# EAGLE design Z-Control-V2 (EAGLE 8.2.2)
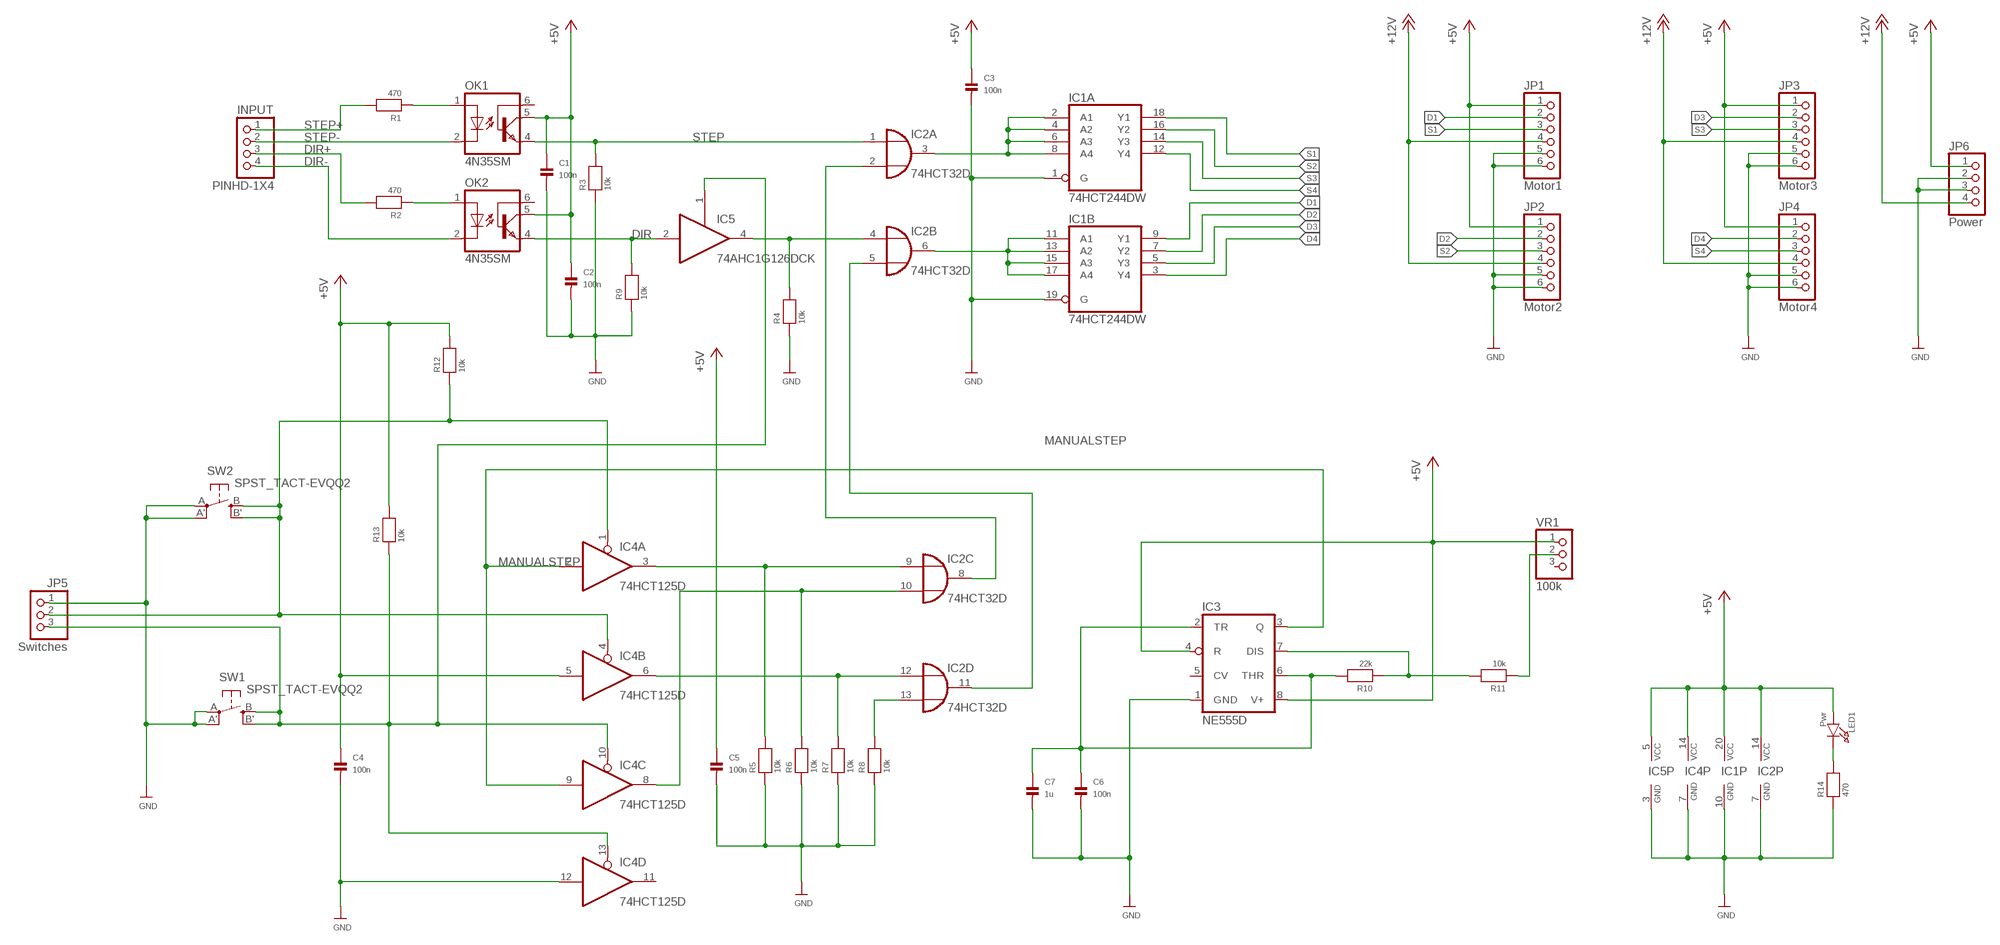
[diagram p0: schematic, sheet 1]

## Parts
C1  100n  CAP_CERAMIC_0805  [_0805]
C2  100n  CAP_CERAMIC_0805  [_0805]
C3  100n  CAP_CERAMIC_0805  [_0805]
C4  100n  CAP_CERAMIC_0805  [_0805]
C5  100n  CAP_CERAMIC_0805  [_0805]
C6  100n  CAP_CERAMIC_0805  [_0805]
C7  1u  CAP_CERAMIC_0805  [_0805]
IC1  74HCT244DW  [SO20W]
IC2  74HCT32D  [SO14]
IC3  NE555D  [SO08]
IC4  74HCT125D  [SO14]
IC5  74AHC1G126DCK  [SC70-5]
INPUT  PINHD-1X4  [1X04-BIG]
JP1  Motor1  PINHD-1X6  [1X06]
JP2  Motor2  PINHD-1X6  [1X06]
JP3  Motor3  PINHD-1X6  [1X06]
JP4  Motor4  PINHD-1X6  [1X06]
JP5  Switches  PINHD-1X3  [1X03]
JP6  Power  PINHD-1X4  [1X04-BIG]
LED1  Pwr  LED0805  [CHIPLED_0805]
OK1  4N35SM  [DIL6-SMD]
OK2  4N35SM  [DIL6-SMD]
R1  470  RESISTOR_0805  [_0805]
R2  470  RESISTOR_0805  [_0805]
R3  10k  RESISTOR_0805  [_0805]
R4  10k  RESISTOR_0805  [_0805]
R5  10k  RESISTOR_0805  [_0805]
R6  10k  RESISTOR_0805  [_0805]
R7  10k  RESISTOR_0805  [_0805]
R8  10k  RESISTOR_0805  [_0805]
R9  10k  RESISTOR_0805  [_0805]
R10  22k  RESISTOR_0805  [_0805]
R11  10k  RESISTOR_0805  [_0805]
R12  10k  RESISTOR_0805  [_0805]
R13  10k  RESISTOR_0805  [_0805]
R14  470  RESISTOR_0805  [_0805]
SW1  SPST_TACT-EVQQ2  [EVQ-Q2]
SW2  SPST_TACT-EVQQ2  [EVQ-Q2]
VR1  100k  HEADER-1X3  [1X03_OVAL]

## Nets
+5V: C1.1 C2.1 C3.1 C4.1 C5.1 IC1.20(P:VCC) IC2.14(P:VCC) IC3.4(R) IC3.8(V+) IC4.5(B:I) IC4.14(P:VCC) IC5.5(VCC) JP1.1 JP2.1 JP3.1 JP4.1 JP6.1 LED1.A OK1.5(COL) OK2.5(COL) R12.2 R13.2 VR1.1
+12V: JP1.4 JP2.4 JP3.4 JP4.4 JP6.4
D1: IC1.9(B:Y1) JP1.2
D2: IC1.7(B:Y2) JP2.2
D3: IC1.5(B:Y3) JP3.2
D4: IC1.3(B:Y4) JP4.2
DIR: IC5.2(I) OK2.4(EMI) R9.2
DIR+: INPUT.3 R2.2
DIR-: INPUT.4 OK2.2(C)
GND: C1.2 C2.2 C3.2 C4.2 C5.2 C6.2 C7.2 IC1.1(A:G) IC1.10(P:GND) IC1.19(B:G) IC2.7(P:GND) IC3.1(GND) IC4.7(P:GND) IC4.12(D:I) IC5.3(GND) JP1.5 JP1.6 JP2.5 JP2.6 JP3.5 JP3.6 JP4.5 JP4.6 JP5.1 JP6.2 JP6.3 R3.1 R4.1 R5.1 R6.1 R7.1 R8.1 R9.1 R14.1 SW1.A'(P1) SW1.A(P) SW2.A'(P1) SW2.A(P)
MANUALSTEP: IC3.3(Q) IC4.2(A:I) IC4.9(C:I)
N$1: IC4.10(C:OE) IC4.13(D:OE) IC5.1(OE) JP5.3 R13.1 SW1.B'(S1) SW1.B(S)
N$2: IC2.13(D:I1) R8.2
N$3: OK1.1(A) R1.1
N$4: IC2.4(B:I0) IC5.4(O) R4.2
N$5: OK2.1(A) R2.1
N$6: IC4.1(A:OE) IC4.4(B:OE) JP5.2 R12.1 SW2.B'(S1) SW2.B(S)
N$7: IC1.2(A:A1) IC1.4(A:A2) IC1.6(A:A3) IC1.8(A:A4) IC2.3(A:O)
N$8: IC1.11(B:A1) IC1.13(B:A2) IC1.15(B:A3) IC1.17(B:A4) IC2.6(B:O)
N$17: IC2.9(C:I0) IC4.3(A:O) R5.2
N$18: IC2.12(D:I0) IC4.6(B:O) R7.2
N$19: IC2.2(A:I1) IC2.8(C:O)
N$20: IC2.5(B:I1) IC2.11(D:O)
N$22: IC2.10(C:I1) IC4.8(C:O) R6.2
N$23: LED1.C R14.2
N$25: C6.1 C7.1 IC3.2(TR) IC3.6(THR) R10.2
N$26: IC3.7(DIS) R10.1 R11.2
N$27: R11.1 VR1.2
S1: IC1.18(A:Y1) JP1.3
S2: IC1.16(A:Y2) JP2.3
S3: IC1.14(A:Y3) JP3.3
S4: IC1.12(A:Y4) JP4.3
STEP: IC2.1(A:I0) OK1.4(EMI) R3.2
STEP+: INPUT.1 R1.2
STEP-: INPUT.2 OK1.2(C)
Unconnected: IC3.5(CV) IC4.11(D:O) OK1.6(BAS) OK2.6(BAS) VR1.3

## Library data of the parts
C1-C7 = microbuilder:CAP_CERAMIC: Ceramic Capacitors 0402 - 0402 Surface Mount Capacitors 16pF 50V 5% [Digikey: 445-4899-2-ND] 18pF 50V 5% [Digikey: 490-1281-2-ND] 22pF 50V 5% [Digikey: 490-1283-2-ND] 68pF 50V 5% [Digikey: 490-1289-2-ND] 0.1uF 10V 10% [Digikey: 490-1318-2-ND] 1.0uF 6.3V 10% [Digikey: 490-1320-2-ND] 0603 - 0603 Surface Mount Capacitors 16 pF 50V 5% [Digikey: 445-5051-2-ND] 22 pF 50V [Digikey: PCC220ACVTR-ND] 33 pF 50V 5% [Digikey: 490-1415-1-ND] 56pF 50V 5% [Digikey: 490-1421-1-ND] 220pF 50V 5% [Digikey: 445-1285-1-ND] 680 pF 50V 2200 pF 50V 5% C0G [Digikey: 445-1297-1-ND] 5600 pF 100V 5% X7R [Digikey: 478-3711-1-ND] 0.1 µF 25V 10% [Digikey: PCC2277TR-ND] 0.22 µF 16V 10% X7R [Digikey: 445-1318-1-ND] 1.0 µF 25V 10% [Digikey: 445-5146-2-ND] 0603 - RF Specific 3pF 250V +/-0.1pF RF [Digikey: 712-1347-1-ND] 18 pF 250V 5% [Digikey: 478-3505-1-ND or 712-1322-1-ND] 56 pF 250V 5% C0G RF [Digikey: 490-4867-1-ND] 68 pF 250V RF [Digikey: 490-4868-1-ND] 0805 - 0805 Surface Mount Capacitors 220 pF 250V 2% RF Ceramic Capacitor [Digikey: 712-1398-1-ND] 1000 pF 50V 2% NP0 Ceramic Capacitor [Digikey: 478-3760-1-ND] 0.1 µF 25V 10% Ceramic Capacitor [Digikey: PCC1828TR-ND] 1.0 µF 16V 10% Ceramic Capacitor[Digikey: 490-1691-2-ND] 10.0 µF 10V 10% Ceramic Capacitor[Digikey: 709-1228-1-ND] 10.0 uF 16V 10% Ceramic Capacitor [Digikey: 478-5165-2-ND] 47 uF 6.3V 20% Ceramic Capacitor [Digikey: 587-1779-1-ND or 399-5506-1-ND] 1206 - 1206 Surface Mount Capacitors 47uF 10V 20% Ceramic Capacitor [Digikey: 490-5528-1-ND or 399-5508-1-ND or 445-6010-1-ND] 100uF 6.3V -20%, +80% Y5V Ceramic Capacitor (Digikey: 490-4512-1-ND, Mouser: 81-GRM31CF50J107ZE1L)
IC1 = 74xx-eu:74*244: Octal BUFFER and LINE DRIVER, 3-state
IC2 = 74xx-eu:74*32: Quad 2-input OR gate
IC3 = adafruit:*555: TIMER Changed DIP package to have round (not oval) pin pads http://www.ladyada.net/library/pcb/eaglelibrary.html
IC4 = 74xx-eu:74*125: Quad bus BUFFER, 3-state
IC5 = 74xx-little-us:74*1G126: Single Bus Buffer Gate With 3-State Outputs
INPUT JP6 = adafruit:PINHD-1X4
JP1-JP4 = adafruit:PINHD-1X6: PIN HEADER
JP5 = adafruit:PINHD-1X3: PIN HEADER
LED1 = microbuilder:LED: LED 0603 - 0603 Surface Mount Package 2mA: Green LED - Low Power (3.9mcd, 2ma, 1.7Vf) - Digikey: 475-2709-2-ND Orange LED - Low Power (9.8mcd, 2ma, 1.8Vf) - Digikey: 475-1194-2-ND Red LED - Low Power (5mcd, 2ma, 1.8Vf) - Digikey: 475-1195-2-ND Yellow LED - Low Power (7mcd, 2ma, 1.8Vf) - Digikey: 475-1196-2-ND 5mA: Blue LED - Low Power (17mcd, 5ma, 2.9Vf) - Digikey: LNJ937W8CRACT-ND 0805 - 0805 Surface Mount Package 2mA: Red LED (8.8mcd, 2mA, 1.8Vf, Clear) - Low Power [Digikey: 475-2510-1-ND] Green LED (5mcd, 2mA, 1.8Vf, Clear) - Low Power [Digikey: 475-2730-1-ND] Yellow LED (11.3mcd, 2mA, 1.8Vf, Clear) - Low Power [Digikey: 475-2555-1-ND] 20mA: Red LED (104mcd, 20mA, Diffused) - LS R976 [Digikey: 475-1278-6-ND] Red LED (12mcd, 20mA, 2.0Vf, Clear) - APT2012EC [Digikey: 754-1128-1-ND] Green LED (15mcd, 20mA, 2.2Vf, Clear) - APT2012GC [Digikey: 754-1131-1-ND] Orange LED (160mcd, 20mA, 2.1Vf, Clear) - APT2012SECK [Digikey: 754-1130-1-ND] 1206 - 1206 Surface Mount Package Green LED (26mcd, 20mA, Diffused) - LG N971 [Digikey: 475-1407-6-ND] Red LED (15mcd, 20mA, Diffused) - LH N974 [Digikey: 475-1416-6-ND]
OK1 OK2 = optocoupler:4N*?M: General Purpose 6-Pin Phototransistor Optocouplers Source: http://www.fairchildsemi.com/ds/4N/4N35-M.pdf; MF: FAIRCHILD SEMICONDUCTOR; MPN: 4N35S-M; OC_FARNELL: 1021179; OC_NEWARK: 67K2285
R1-R14 = microbuilder:RESISTOR: Resistors 0402 - 0402 Surface Mount Package 22 Ohm 1% 1/16W [Digikey: 311-22.0LRTR-ND] 33 Ohm 5% 1/16W 1.0K 5% 1/16W 1.5K 5% 1/16W 2.0K 1% 1/16W 10.0K 1% 1/16W [Digikey: 311-10.0KLRTR-ND] 10.0K 5% 1/16W [Digikey: RMCF0402JT10K0TR-ND] 12.1K 1% 1/16W [Digikey: 311-22.0LRTR-ND] 100.0K 5% 1/16W 0603 - 0603 Surface Mount Package 0 Ohm 1/10 Watt 1% Resistor 15 Ohm 1/10 Watt 1% Resistor 33 Ohm 1/10 Watt 1% Resistor 49.9 Ohm 1/10 Watt 1% Resistor 100 Ohm 1/10 Watt 1% Resistor 150 Ohm 1/10 Watt 1% Resistor 240 Ohm 1/10 Watt 1% Resistor 390 Ohm 1/10 Watt 1% Resistor 560 Ohm 1/10 Watt 1% Resistor 680 Ohm 1/10 Watt 1% Resistor 750 Ohm 1/10 Watt 1% Resistor 1.0K Ohm 1/10 Watt 1% Resistor 1.5K Ohm 1/10 Watt 1% Resistor 2.0K Ohm 1/10 Watt 1% Resistor 2.2K Ohm 1/10 Watt 1% Resistor 3.3K Ohm 1/10 Watt 1% Resistor 4.7K Ohm 1/10 Watt 1% Resistor 10.0K Ohm 1/10 Watt 1% Resistor 12.0K Ohm 1/10 Watt 1% Resistor 12.1K Ohm 1/10 Watt 1% Resistor 20.0K Ohm 1/10 Watt 1% Resistor 33.0K Ohm 1/10 Watt 1% Resistor 100.0K Ohm 1/10 Watt 1% Resistor 0805 - 0805 Surface Mount Package 0 Ohm 1/8 Watt 1% Resistor 33 Ohm 1/8 Watt 1% Resistor 100 Ohm 1/8 Watt 1% Resistor 150 Ohm 1/8 Watt 1% Resistor 200 Ohm 1/8 Watt 1% Resistor 240 Ohm 1/8 Watt 1% Resistor 330 Ohm 1/8 Watt 1% Resistor 390 Ohm 1/8 Watt 1% Resistor 470 Ohm 1/8 Watt 1% Resistor 1.0K Ohm 1/8 Watt 1% Resistor 1.5K Ohm 1/8 Watt 1% Resistor 2.0K Ohm 1/8 Watt 1% Resistor 4.7K Ohm 1/8 Watt 1% Resistor 5.1K Ohm 1/8 Watt 1% Resistor 5.6K Ohm 1/8 Watt 1% Resistor 10.0K Ohm 1/8 Watt 1% Resistor 22.0K Ohm 1/8 Watt 1% Resistor 33.0K Ohm 1/8 Watt 1% Resistor 100K Ohm 1/8 Watt 1% Resistor 1206 - 1206 Surface Mount Package 2012 - 2010 Surface Mount Package 0.11 Ohm 1/2 Watt 1% Resistor - Digikey: RHM.11UCT-ND
SW1 SW2 = adafruit:SPST_TACT: SMT 6mm switch, EVQQ2 series http://www.ladyada.net/library/eagle
VR1 = microbuilder:HEADER-1X3: PIN HEADER

## Board
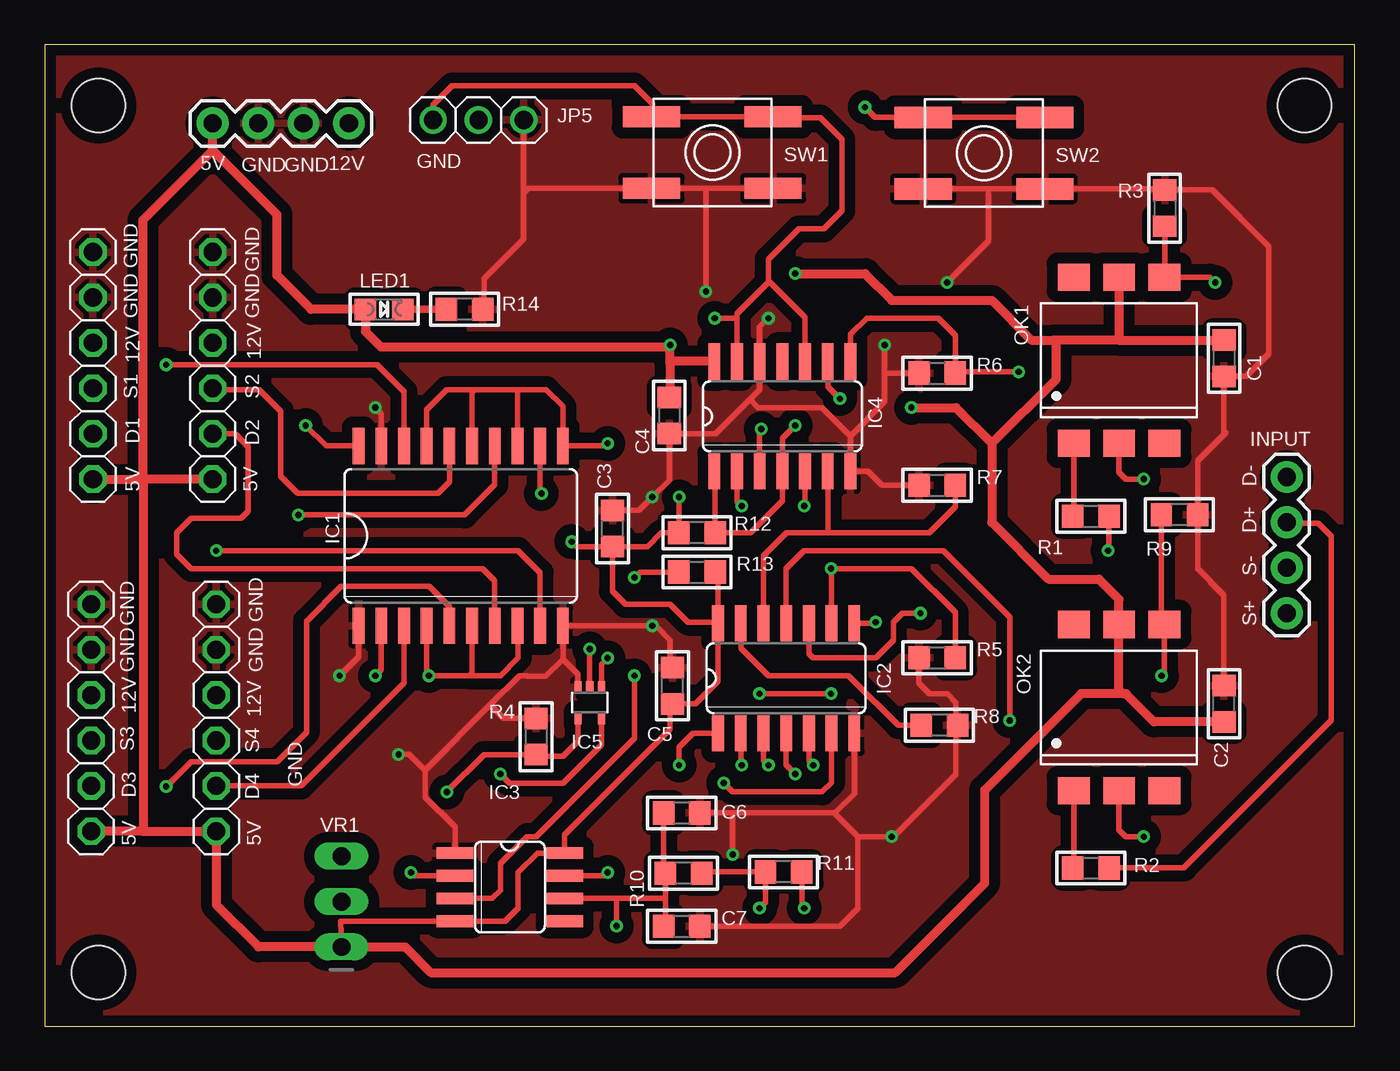
[diagram p1: board, top side]
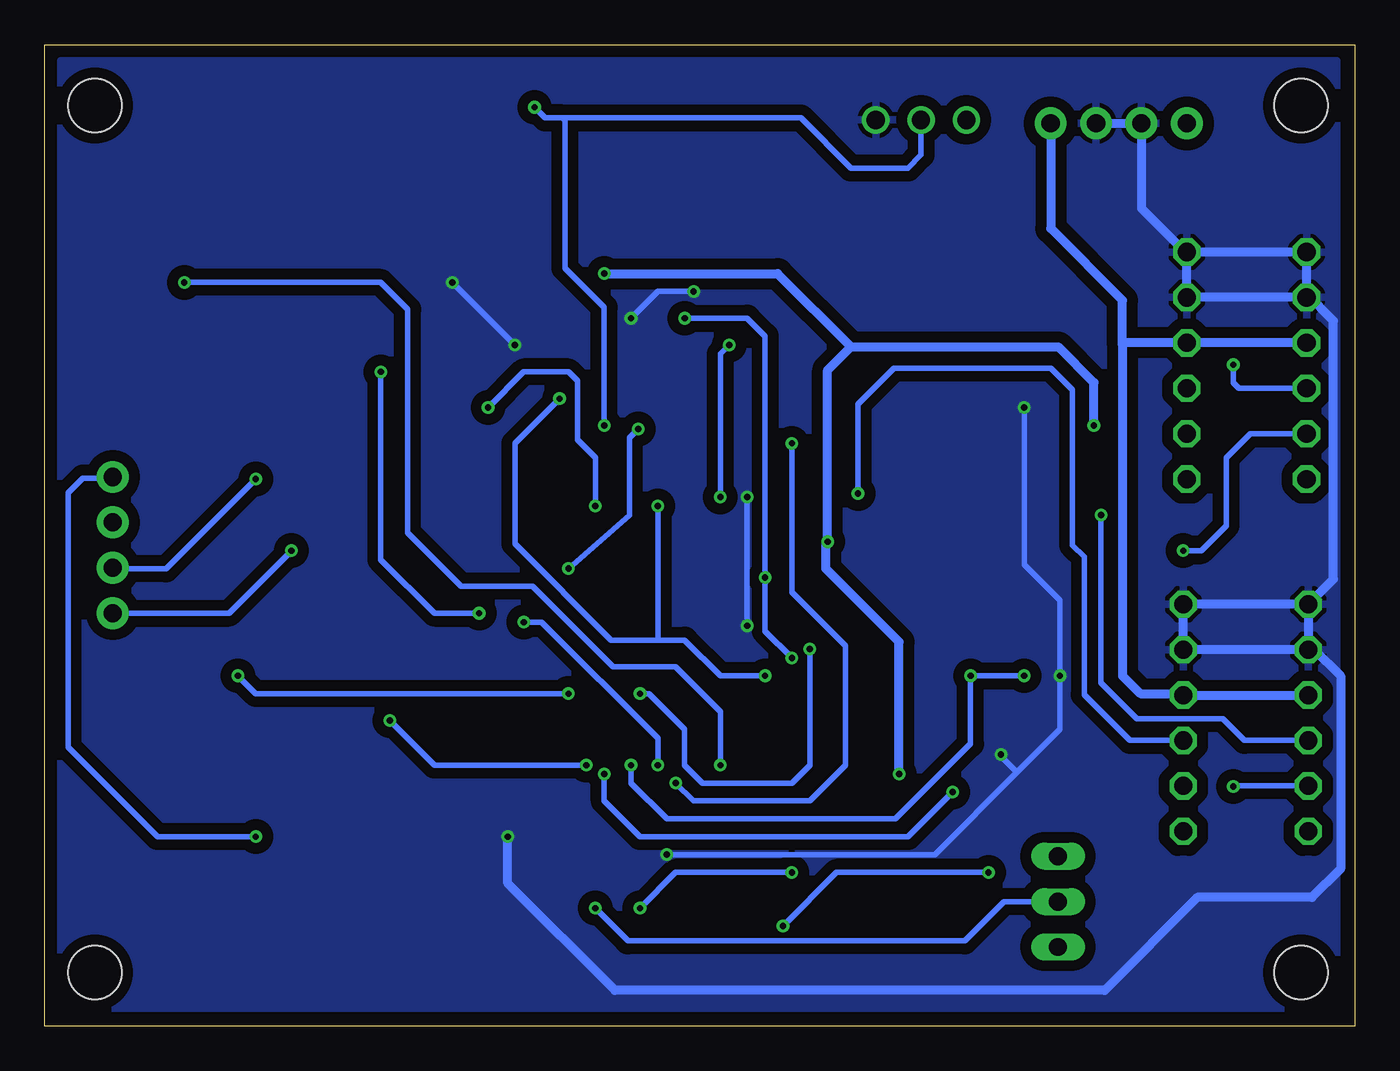
[diagram p2: board, bottom side, seen from below]

Size 73.31 x 54.9 mm. Coordinates in mm from the lower left corner, seen from the top.
Outline: 0,0 73.31,0 73.31,54.9 0,54.9 0,0
Copper layers (1*16): Top 0.0356mm / dielectric 1.5011mm / Bottom 0.0356mm
Design rules "oshpark-2layer": minimum track width 6mil, minimum drill 13mil, track to track 6mil, track to pad 6mil, pad to pad 6mil, via to via 6mil, smd to smd 6mil, copper to edge 15mil, drill to drill 6mil, minimum pad ring 7mil, minimum via ring 7mil, stop-mask expansion 2.5mil, vias tented up to drill 0mil, thermal gap 10mil
Holes 3 mm at 3,51.5 70.5,51.5 70.5,3 3,3

### Footprints (pad centres in the part's own frame; a part is rotated, then mirrored left to right if it is on the bottom)
_0805 = smd 1.2 x 1.3: 1 -1.016,0; 2 1.016,0
SO20W = smd 0.66 x 2.032: 1 -5.715,-5.029; 2 -4.445,-5.029; 3 -3.175,-5.029; 4 -1.905,-5.029; 5 -0.635,-5.029; 6 0.635,-5.029; 7 1.905,-5.029; 8 3.175,-5.029; 9 4.445,-5.029; 10 5.715,-5.029; 11 5.715,5.029; 12 4.445,5.029; 13 3.175,5.029; 14 1.905,5.029; 15 0.635,5.029; 16 -0.635,5.029; 17 -1.905,5.029; 18 -3.175,5.029; 19 -4.445,5.029; 20 -5.715,5.029
SO14 = smd 0.66 x 2.032: 1 -3.81,-3.073; 2 -2.54,-3.073; 3 -1.27,-3.073; 4 0,-3.073; 5 1.27,-3.073; 6 2.54,-3.073; 7 3.81,-3.073; 8 3.81,3.073; 9 2.54,3.073; 10 1.27,3.073; 11 0,3.073; 12 -1.27,3.073; 13 -2.54,3.073; 14 -3.81,3.073
SO08 = smd 0.66 x 2.032: 1 -1.905,-3.073; 2 -0.635,-3.073; 3 0.635,-3.073; 4 1.905,-3.073; 5 1.905,3.073; 6 0.635,3.073; 7 -0.635,3.073; 8 -1.905,3.073
SC70-5 = smd 0.4 x 0.7: 1 -0.65,-0.85; 2 0,-0.85; 3 0.65,-0.85; 4 0.65,0.85; 5 -0.65,0.85
1X04-BIG = drill 1.016 pad 1.778: 1 0,0; 2 2.54,0; 3 5.08,0; 4 7.62,0
1X06 = drill 1.016 octagon: 1 -6.35,0; 2 -3.81,0; 3 -1.27,0; 4 1.27,0; 5 3.81,0; 6 6.35,0
1X03 = drill 1.016: 1 -2.54,0; 2 0,0; 3 2.54,0
CHIPLED_0805 = smd 1.2 x 1.2: A 0,-1.05; C 0,1.05
DIL6-SMD = smd 1.78 x 1.52: 1 -2.54,-4.645; 2 0,-4.645; 3 2.54,-4.645; 4 2.54,4.645; 5 0,4.645; 6 -2.54,4.645
EVQ-Q2 = smd 3.2 x 1.2: A -3.4,-2; A' 3.4,-2; B -3.4,2; B' 3.4,2
1X03_OVAL = drill 1 long: 1 -2.54,0; 2 0,0; 3 2.54,0

### Placement (x,y rotation side)
C1  65.99,37.36 270 top
C2  65.99,18.04 90 top
C3  31.77,27.84 90 top
C4  34.95,34.16 270 top
C5  35.13,19.04 90 top
C6  35.65,11.93 0 top
C7  35.65,5.59 0 top
IC1  23.28,27.43 0 top
IC2  41.49,19.46 0 top
IC3  26.03,7.78 270 top
IC4  41.28,34.11 0 top
IC5  30.5,18.1 180 top
INPUT  69.5,23.1 90 top
JP1  2.7,36.95 90 top
JP2  9.4,36.95 90 top
JP3  2.6,17.25 90 top
JP4  9.6,17.25 90 top
JP5  24.27,50.69 180 top
JP6  9.4,50.5 0 top
LED1  19,40.1 270 top
OK1  60.12,37.25 0 top
OK2  60.12,17.82 0 top
R1  58.54,28.53 0 top
R2  58.54,8.85 0 top
R3  62.67,45.76 270 top
R4  27.5,16.2 270 top
R5  49.94,20.61 0 top
R6  49.94,36.53 0 top
R7  49.94,30.25 0 top
R8  50.06,16.83 180 top
R9  63.5,28.6 180 top
R10  35.75,8.55 180 top
R11  41.35,8.63 180 top
R12  36.5,27.6 180 top
R13  36.5,25.4 0 top
R14  23.5,40.1 180 top
SW1  37.36,48.87 0 top
SW2  52.56,48.84 0 top
VR1  16.61,6.97 90 top

### Tracks (layer width: path | path; a pad name or v marks a point on that pad's centre or on a via)
+5V  (via drill 0.35)
  Top 0.305: IC2.14 37.68,25.24 R13.2 | C3.1 33.72,26.82 34.5,27.6 R12.2 35.48,29.58 v35.5,29.6 | 37.39,37.1 IC4.14 | 35.02,38.1 v35,38.1 | v14.6,33.6 14.61,33.59 15.75,32.46 IC1.20 | C3.1 29.78,26.82 v29.5,27.1 | IC2.14 37.68,19.28 36.42,18.02 C5.1 35.05,18.1 35,18.05 35,16.6 29.1,10.7 IC3.8 27.59,9.69 26.5,8.6 26.5,6.6 25.77,5.88 IC3.4 16.57,5.88 VR1.1 | C3.1 31.77,24.33 32.5,23.6 35,23.6 36,22.6 37.61,22.6 IC2.14 | 17.5,40.1 LED1.A | IC4.5 42.55,29.15 v42.5,29.1 | IC5.5 31.15,15.75 29,13.6 26,13.6 v25.5,14.1
  Top 0.508: 5.5,30.56 5.5,45.1 9.4,49 | 5.5,10.9 JP3.1 | 5.5,10.9 JP4.1 9.6,6.8 11.97,4.43 VR1.1 20.17,4.43 21.6,3 47.6,3 52.6,8 52.6,13.2 58,18.6 60.34,18.6 | 5.5,30.56 5.5,10.9 | JP1.1 5.46,30.6 5.5,30.56 | 9.4,49 JP6.1 | JP2.1 5.54,30.6 5.5,30.56 | 60.34,18.6 60.5,18.6 62.08,17.02 C2.1 | 60.34,18.6 60.12,18.82 OK2.5 60.12,23.88 59,25 56.17,25 53,28.18 53,32.6 | 53,32.6 56.6,36.2 56.6,38.23 56.46,38.38 | v48.5,34.6 51,34.6 53,32.6 | 60.07,38.38 56.46,38.38 | 60.07,38.38 C1.1 | 56.46,38.38 55.22,38.38 53,40.6 47.4,40.6 45.9,42.1 v42,42.1 | OK1.5 60.12,38.42 60.07,38.38 | 9.4,49 13,45.4 13,42 14.9,40.1 LED1.A 17.95,38.85 18.8,38 34.92,38 35.02,38.1 | 35,37.02 v35,38.1 | 35,37.02 35,35.23 C4.1 | IC4.14 35.17,37.18 35,37.02
  Bottom 0.305: v35.5,29.6 35.5,37.6 v35,38.1 | v42.5,29.1 42.5,31.8 43.5,32.8 43.5,36.1 44,36.6 46.5,36.6 v48.5,34.6
  Bottom 0.508: v25.5,14.1 25.5,21.5 29.6,25.6 29.6,27 v29.5,27.1 29.5,36.7 28.2,38 | v14.6,33.6 14.6,36 16.6,38 28.2,38 | v42,42.1 32.3,42.1 28.2,38
+12V
  Bottom 0.508: JP1.4 JP2.4 12.88,38.22 13,38.1 | 13,38.1 13,40.6 17.02,44.62 JP6.4 | 13,38.1 13,19.6 12,18.6 9.68,18.6 JP4.4 JP3.4
D1  (via drill 0.35)
  Top 0.305: IC1.9 27.73,25.38 26.5,26.6 v9.6,26.6
  Bottom 0.305: JP1.2 5.86,33.14 7.2,31.8 7.2,28 8.6,26.6 v9.6,26.6
D2
  Top 0.305: IC1.7 25.18,24.91 24.5,25.6 8.2,25.6 7.4,26.4 7.4,27.6 8.2,28.4 11,28.4 11.4,28.8 11.4,32.4 10.66,33.14 JP2.2
D3  (via drill 0.35)
  Top 0.305: IC1.5 22.64,23.45 21.5,24.6 16.6,24.6 14.65,22.65 14.65,16.45 13,14.8 8.2,14.8 v6.8,13.4
  Bottom 0.305: JP3.2 6.76,13.44 v6.8,13.4
D4
  Top 0.305: IC1.3 20.11,19.2 18.51,17.61 | 18.51,17.61 18.19,17.29 | JP4.2 14.34,13.44 18.51,17.61
DIR  (via drill 0.35)
  Top 0.305: 62.64,22.48 OK2.4 62.66,22.35 | 62.66,22.35 62.66,19.76 v62.5,19.6 | v44,18.6 v40,18.6 | IC5.2 v30.5,21.1 | R9.2 62.48,22.53 62.66,22.35
  Bottom 0.305: v44,18.6 61.5,18.6 v62.5,19.6 | v40,18.6 39.5,18.6 37.5,16.6 37.5,14.6 36.5,13.6 31.5,13.6 30.5,14.6 v30.5,21.1
DIR+
  Top 0.305: R2.2 63.75,8.85 72,17.1 72,27.39 71.27,28.12 69.56,28.12 INPUT.3
DIR-  (via drill 0.35)
  Top 0.305: OK2.2 60.12,10.98 60.5,10.6 v61.5,10.6
  Bottom 0.305: v61.5,10.6 67,10.6 72,15.6 72,29.83 71.17,30.66 69.56,30.66 INPUT.4
GND  (via drill 0.35)
  Top 0.305: IC1.19 18.84,34.27 v18.5,34.6 | IC1.1 17.57,20.66 v16.5,19.6 | IC3.1 22.96,11.14 21.28,12.82 21.28,14.32 | 38.41,11.93 C6.2 | 38.41,11.93 44.17,11.93 44.2,11.9 | 44.2,11.9 45.5,10.6 | 45.5,10.6 45.5,6.6 44.49,5.59 C7.2 | 65.99,33.09 C1.2 67.24,36.34 68.5,37.6 68.5,43.6 65.32,46.78 R3.1 62.61,46.84 SW2.A' 52.8,46.84 | 66.1,33.2 65.99,33.09 | 36.96,46.87 SW1.A' | 36.96,46.87 SW1.A 27.08,46.87 26.81,46.6 | IC2.7 45.3,13 44.2,11.9 | R7.1 46.85,30.25 46.06,31.04 IC4.7 45.09,33.01 | 34.05,22.4 IC1.10 29,20.53 | 34.05,22.4 34.2,22.4 35,21.6 35,20.19 C5.2 | 39.46,35.06 40,35.6 IC4.12 40.01,39.11 v40.5,39.6 | 45.09,33.01 43.5,34.6 39.91,34.6 39.46,35.06 | 48.61,36.53 R6.1 47.04,36.53 47,36.57 | 45.09,33.01 47,34.92 47,36.57 | 39.46,35.06 37.54,33.14 C4.2 34.95,30.55 v34,29.6 | 47,36.57 v47,38.1 | 36.96,41.14 v37,41.1 37,46.83 36.96,46.87 | v34,29.6 33.86,29.6 | v34,22.4 34,22.45 34.05,22.4 | 29,20.53 28.03,19.57 27.03,19.57 27,19.6 26.56,19.6 24.93,17.97 | v38.5,9.6 38.5,11.84 38.41,11.93 | 45.5,10.6 v47.4,10.6 47.5,10.6 51,14.1 51,16.75 | 51,16.75 R8.1 | R5.1 48.92,19.18 49.5,18.6 50.5,18.6 51,18.1 51,16.75 | C3.2 33.26,28.86 v34,29.6 | C2.2 65.99,24.11 64.52,25.58 R9.1 64.52,31.62 65.99,33.09 | 21.28,14.32 24.93,17.97 | R4.1 25.68,17.22 24.93,17.97 | IC5.3 29.85,19.67 29,20.53 | 26.81,46.6 JP5.1 | 26.81,46.6 26.81,44.01 24.6,41.8 24.6,40.18 R14.1 | SW2.A 52.8,46.84 | 52.8,46.84 52.8,43.9 v50.5,41.6 | v19.8,15.2 20.4,15.2 21.28,14.32
  Bottom 0.305: v50.5,41.6 v47,38.1 | v37,41.1 39,41.1 v40.5,39.6 | v34,29.6 v34,22.4 | v18.5,34.6 18.5,25.82 16.5,23.82 v16.5,19.6 16.5,16.6 18.9,14.2 | v38.5,9.6 23.5,9.6 18.9,14.2 | v19.8,15.2 19.8,15.1 18.9,14.2
  Bottom 0.508: 2.7,40.95 JP1.5 JP2.5 9.4,43.21 | 2.7,40.95 JP1.6 JP2.6 9.4,43.21 | JP3.6 JP3.5 | JP3.6 JP4.6 JP4.5 JP3.5 | JP6.3 JP6.2 11.94,45.75 9.4,43.21 | JP3.6 1.2,25 1.2,39.45 2.7,40.95 | JP3.5 2.26,21.06 0.8,19.6 0.8,8.8 2.4,7.2 8.8,7.2 14,2 41.4,2 47.4,8 v47.4,10.6
  pour Top (isolate 0.61): 0.4,54.8 73,54.8 73,0.4 0.4,0.4
  pour Bottom (isolate 0.61): 1,54 72.4,54 72.4,1 1,1 1,53.8
MANUALSTEP  (via drill 0.35)
  Top 0.305: IC3.3 25.05,7.14 25.5,7.6 25.5,9.1 27,10.6 27.5,10.6 33,16.1 v33,19.6 | IC4.9 43.82,35.78 v44.5,35.1 | IC4.2 38.74,29.36 v39,29.1
  Bottom 0.305: v44.5,35.1 47,32.6 47,27 41.6,21.6 38.95,21.6 | v33,19.6 35.5,19.6 37.5,21.6 38.95,21.6 | v39,29.1 39,21.65 38.95,21.6
N$1  (via drill 0.35)
  Top 0.305: 38.74,39.63 IC4.13 | 38.74,39.63 38.74,39.84 40.5,41.6 40.5,41.71 | IC4.10 42.55,39.66 40.5,41.71 | R13.1 33.3,25.4 v33,25.1 | v37.5,39.6 38.71,39.6 38.74,39.63 | IC5.1 31.15,20.25 v31.5,20.6 | JP5.3 21.73,51.53 22.8,52.6 33,52.6 34,51.6 34,50.91 SW1.B SW1.B' | 40.5,41.71 40.5,42.9 42.2,44.6 43.6,44.6 44.6,45.6 44.6,49.6 43.4,50.8 40.83,50.8 | 40.83,50.8 SW1.B' | SW1.B' 40.83,50.8
  Bottom 0.305: v37.5,39.6 34,39.6 33,38.6 v33,25.1 33,22.1 v31.5,20.6
N$2
  Top 0.305: IC2.13 38.95,21.15 40.5,19.6 44.98,19.6 46.48,18.1 46.5,18.1 47.77,16.83 R8.2
N$3
  Top 0.305: OK1.1 57.58,28.59 R1.1
N$4  (via drill 0.35)
  Top 0.305: IC2.4 41.49,14.61 v42,14.1 | IC5.4 29.85,15.95 29,15.1 27.58,15.1 R4.2 24.58,15.18 v22.5,13.1
  Bottom 0.305: v42,14.1 42,12.6 40,10.6 25,10.6 v22.5,13.1
N$5
  Top 0.305: OK2.1 57.58,8.91 R2.1
N$6  (via drill 0.35)
  Top 0.305: SW2.B' SW2.B 46.46,50.84 v45.9,51.4 | IC4.1 37.52,30.99 R12.1 39.5,27.6 41.28,29.38 IC4.4 41.28,32.88 v42,33.6
  Bottom 0.305: v42,33.6 42,40.2 44.2,42.4 44.2,50.67 44.33,50.8 | JP5.2 24.27,48.73 25,48 28.2,48 31,50.8 44.33,50.8 | 44.33,50.8 45.3,50.8 v45.9,51.4
N$7  (via drill 0.35)
  Top 0.305: IC1.4 21.38,19.73 v21.5,19.6 23.79,19.6 | IC1.2 18.84,19.93 v18.5,19.6 | 23.79,19.6 25.5,19.6 26.5,20.6 26.5,22.36 IC1.8 | IC1.6 23.91,19.73 23.79,19.6 | IC2.3 40.22,14.88 v40.5,14.6
  Bottom 0.305: v18.5,19.6 v21.5,19.6 21.5,15.79 25.69,11.6 38.5,11.6 40.5,13.6 v40.5,14.6
N$8  (via drill 0.35)
  Top 0.305: IC1.17 21.38,34.48 22.5,35.6 24.06,35.6 | 26.39,35.6 24.06,35.6 | 26.39,35.6 28.06,35.6 29,34.66 IC1.11 31.36,32.46 v31.5,32.6 | IC1.15 23.91,35.45 24.06,35.6 | IC1.13 26.45,35.54 26.39,35.6 | IC2.6 44.03,13.63 43.5,13.1 38.5,13.1 v38,13.6
  Bottom 0.305: v31.5,32.6 31.5,24.28 28.5,21.28 28.5,14.6 30.5,12.6 37,12.6 v38,13.6
N$17  (via drill 0.35)
  Top 0.305: IC4.3 40.01,33.31 v40.1,33.4 | R5.2 50.96,23.14 48.5,25.6 v44,25.6 44.03,25.57 IC2.9
  Bottom 0.305: v44,25.6 40.58,28.58 40.58,32.92 v40.1,33.4
N$18
  Top 0.305: IC2.12 40.22,26.32 41.5,27.6 43.8,27.6 | R7.2 50.96,29.06 49.5,27.6 43.8,27.6 | 43.8,27.6 43.82,27.62 IC4.6
N$19  (via drill 0.35)
  Top 0.305: IC2.8 46.57,22.53 v46.5,22.6 | IC2.2 38.95,14.65 v39,14.6
  Bottom 0.305: v39,14.6 39,16.1 45.5,22.6 v46.5,22.6
N$20  (via drill 0.35)
  Top 0.305: IC2.11 41.49,25.59 42.5,26.6 50.29,26.6 54,22.89 v54,17.1 | IC2.5 42.76,14.84 v43,14.6
  Bottom 0.305: v43,14.6 51.5,14.6 v54,17.1
N$22  (via drill 0.35)
  Top 0.305: R6.2 | R6.2 50.96,38.64 50,39.6 46,39.6 45.09,38.69 IC4.8 | v54.5,36.6 51.02,36.6 R6.2 | IC2.10 42.76,20.84 43,20.6 46.5,20.6 47.5,21.6 47.5,22.6 48,23.1 v49,23.1
  Bottom 0.305: v54.5,36.6 54.5,26.1 51.5,23.1 v49,23.1
N$23
  Top 0.406: LED1.C R14.2
N$25  (via drill 0.35)
  Top 0.305: C6.1 34.63,8.65 R10.2 34.73,7.04 | 34.73,7.04 34.73,5.69 C7.1 | 31.95,7.14 IC3.6 | 31.95,7.14 34.62,7.14 34.73,7.04 | IC3.2 20.68,8.41 v20.5,8.6 | v32,5.6 32,7.09 31.95,7.14
  Bottom 0.305: v20.5,8.6 29,8.6 v32,5.6
N$26  (via drill 0.35)
  Top 0.305: R10.1 36.85,8.63 R11.2 40.33,6.93 v40,6.6 | IC3.7 31.32,8.41 v31.5,8.6
  Bottom 0.305: v31.5,8.6 38,8.6 v40,6.6
N$27  (via drill 0.35)
  Top 0.305: R11.1 42.37,6.73 v42.5,6.6
  Bottom 0.305: v42.5,6.6 40.67,4.77 21.83,4.77 19.63,6.97 VR1.2
S1  (via drill 0.35)
  Top 0.305: v6.8,37 18.6,37 20.11,35.49 IC1.18
  Bottom 0.305: JP1.3 6.48,35.68 6.8,36 v6.8,37
S2
  Top 0.305: IC1.16 22.64,30.45 22,29.8 14.16,29.8 13.2,30.76 13.2,34.4 12,35.6 9.48,35.6 JP2.3
S3  (via drill 0.35)
  Top 0.305: IC1.14 25.18,30.29 23.5,28.6 v14.2,28.6
  Bottom 0.305: JP3.3 6.18,15.98 7.4,17.2 12.2,17.2 14.2,19.2 v14.2,28.6
S4  (via drill 0.35)
  Top 0.305: IC1.12 27.73,29.88 v27.8,29.8
  Bottom 0.305: JP4.3 12.58,15.98 15.14,18.54 15.14,26.26 15.8,26.91 15.8,35.6 17,36.8 25.8,36.8 27.8,34.8 v27.8,29.8
STEP  (via drill 0.35)
  Top 0.305: R3.2 62.67,41.91 OK1.4 65.2,41.9 v65.5,41.6 | IC2.1 36.29,16.39 35.5,15.6 v35.5,14.6
  Bottom 0.305: v35.5,14.6 35.5,17.6 38,20.1 41.5,20.1 46,24.6 50,24.6 53,27.6 53,40.1 54.5,41.6 v65.5,41.6
STEP+  (via drill 0.35)
  Top 0.305: R1.2 59.56,26.66 v59.5,26.6
  Bottom 0.305: v59.5,26.6 63,23.1 INPUT.1
STEP-  (via drill 0.35)
  Top 0.305: OK1.2 60.12,30.98 60.5,30.6 v61.5,30.6
  Bottom 0.305: v61.5,30.6 66.52,25.58 69.44,25.58 INPUT.2

### Text on the board
tNames: 5V | 12V | GND | GND | GND | GND | GND | GND | GND | 12V | 12V | S1 | S2 | D1 | D2 | 5V | 5V | D- | D+ | S- | GND | GND | S+ | GND | GND | 12V | 12V | S3 | S4 | D3 | D4 | GND | 5V | 5V